# EAGLE design Precharge Board (EAGLE 6.5.1)
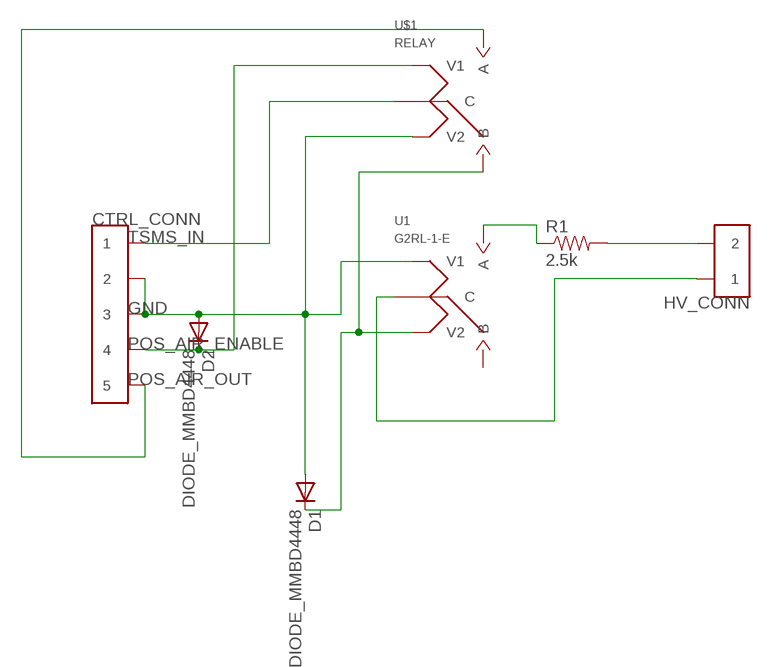
[diagram p0: schematic, sheet 1]

## Parts
CTRL_CONN  CONN_5  [CONNECTOR_5]
D1  DIODE_MMBD4448  [SOT-23-3]
D2  DIODE_MMBD4448  [SOT-23-3]
HV_CONN  CONN_2  [CONNECTOR_2]
R1  2.5k  FS20SERIES  [VISHAY_FS20W_RES]
U1  G2RL-1-E  [G2RL-1-E_RELAY]
U$1  RELAY  [RELAY]

## Nets
GND: CTRL_CONN.3 CTRL_CONN.4 CTRL_CONN.5 CTRL_CONN.6 D1.P$2(A) D2.P$2(A) U1.P$1(V1) U$1.V2
N$4: HV_CONN.3 HV_CONN.4 R1.P$2
N$5: HV_CONN.1 HV_CONN.2 U1.P$3(C) U1.P$6(C)
N$6: D1.P$1(C) U1.P$8(V2) U$1.B
N$9: R1.P$1 U1.P$4(A) U1.P$5(A)
POS_AIR_ENABLE: CTRL_CONN.7 CTRL_CONN.8 D2.P$1(C) U$1.V1
POS_AIR_OUT: CTRL_CONN.9 CTRL_CONN.10 U$1.A
TSMS_IN: CTRL_CONN.1 CTRL_CONN.2 U$1.CENTER(C)
Unconnected: U1.P$2(B) U1.P$7(B)

## Library data of the parts
CTRL_CONN = formula electric:CONN_5
D1 D2 = formula electric:DIODE_MMBD4448
HV_CONN = formula electric:CONN_2
R1 = formula electric:FS20SERIES: Digikey FS20-{R}
U1 = formula electric:G2RL-1-E: G2RL-1-E SPDT Relay, 16A, Digikey: Z2834-ND; COIL: DC 12
U$1 = formula electric:RELAY: Digikey: PB1321-ND

## Board
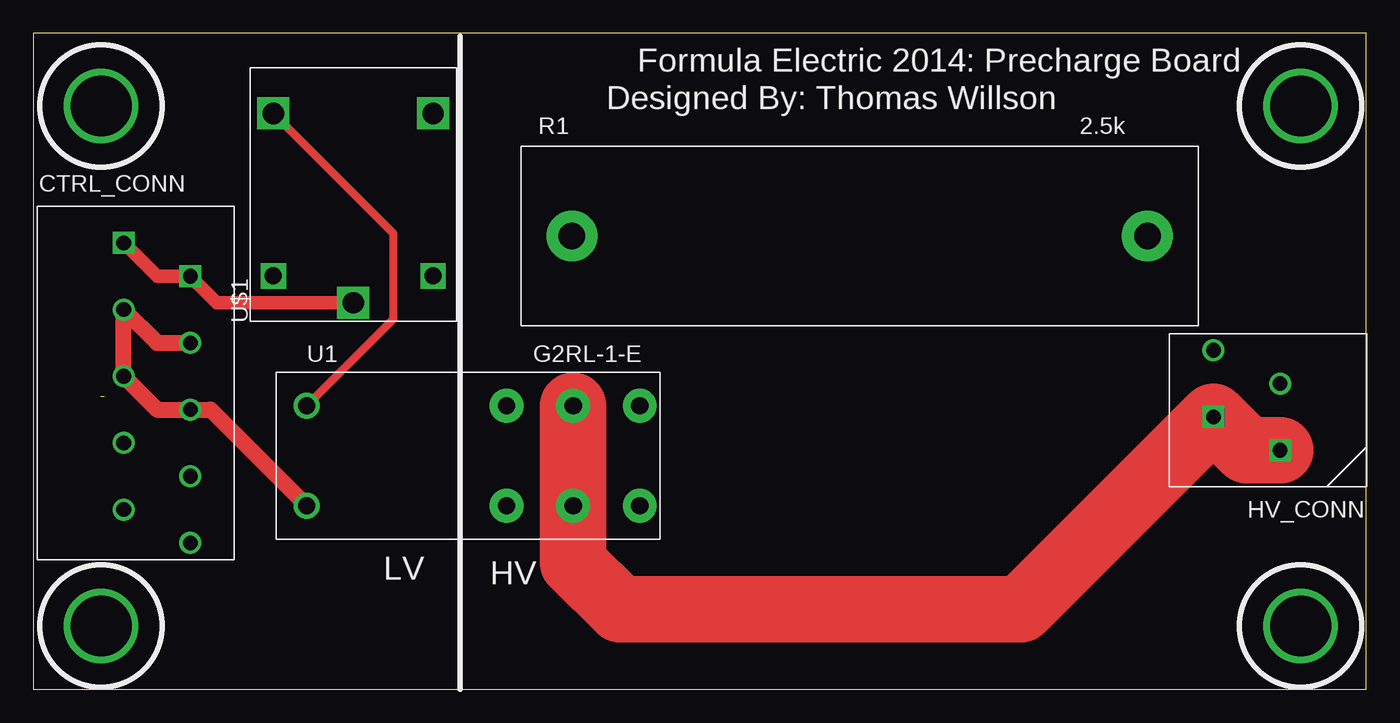
[diagram p1: board, top side]
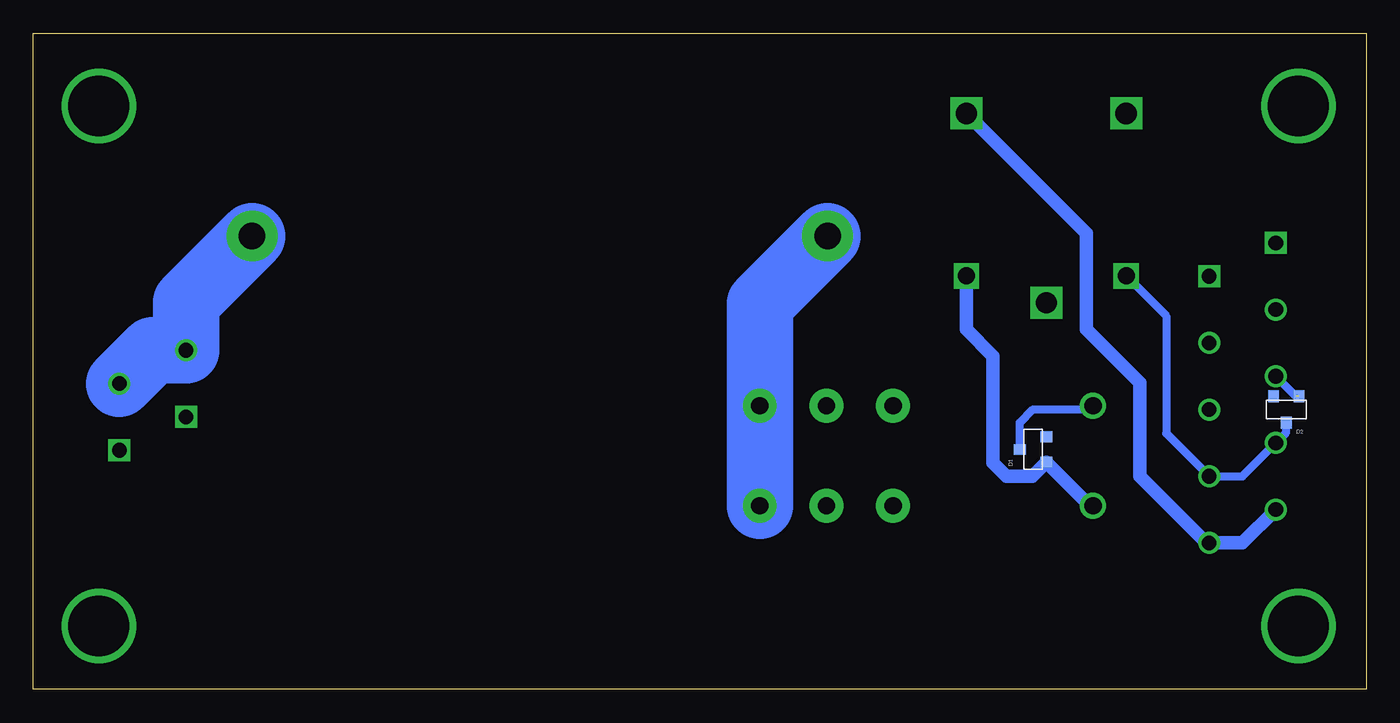
[diagram p2: board, bottom side, seen from below]

Size 100 x 49.2 mm. Coordinates in mm from the lower left corner, seen from the top.
Outline: 0,0 100,0 100,49.2 0,49.2 0,0
Copper layers (1*16): Top 0.035mm / dielectric 1.5mm / Bottom 0.035mm
Design rules "default": minimum track width 10mil, minimum drill 24mil, track to track 8mil, track to pad 8mil, pad to pad 8mil, via to via 8mil, smd to smd 8mil, copper to edge 40mil, drill to drill 8mil, minimum pad ring 10mil, minimum via ring 8mil, stop-mask expansion 4mil, vias tented up to drill 0mil, thermal gap 10mil

### Footprints (pad centres in the part's own frame; a part is rotated, then mirrored left to right if it is on the bottom)
CONNECTOR_5 = drill 1.1 square: 1 0,0; 2 2.5,5 | drill 1.1: 3 5,0; 4 7.5,5; 5 10,0; 6 12.5,5; 7 15,0; 8 17.5,5; 9 20,0; 10 22.5,5
SOT-23-3 = smd 0.8 x 0.9: P$1 0,1; P$2 -0.95,-1; P$3 0.95,-1
CONNECTOR_2 = drill 1.1 square: 1 0,0; 2 2.5,5 | drill 1.1: 3 5,0; 4 7.5,5
VISHAY_FS20W_RES = drill 1.981 pad 3.81: P$1 -21.59,0; P$2 21.59,0
G2RL-1-E_RELAY = drill 1.3: P$1 -15,-3.75; P$8 -15,3.75 | drill 1.3 pad 2.54: P$2 0,-3.75; P$3 5,-3.75; P$4 10,-3.75; P$5 10,3.75; P$6 5,3.75; P$7 0,3.75
RELAY = drill 1.6 square: A 14.199,-5.994; B 14.199,5.994; CENTER 0,0 | drill 1.27 square: V1 2.007,5.994; V2 2.007,-5.994

### Placement (x,y rotation side)
CTRL_CONN  6.78,33.48 270 top
D1  25,18 90 bottom
D2  6,21 180 bottom
HV_CONN  93.54,17.93 90 top
R1  62,34 0 top
U1  35.5,17.52 0 top
U$1  24,29 90 top

### Tracks (layer width: path | path; a pad name or v marks a point on that pad's centre or on a via)
GND  (1 unrouted)
  Top 1.2: U1.P$1 13.29,20.98 CTRL_CONN.6 9.28,20.98 CTRL_CONN.5 CTRL_CONN.3 9.28,25.98 CTRL_CONN.4
  Bottom 0.61: U1.P$1 20.72,13.77 | 5.3,22 CTRL_CONN.5
  Bottom 1: 20.72,13.77 D1.P$2 25.05,16 27,16 28,17 28,25 29.99,26.99 U$1.V2
N$3  (via drill 4.57)
  other vias: 5.08,4.75
N$4
  Bottom 5: R1.P$2 88.54,29.05 HV_CONN.4 91.04,25.43 HV_CONN.3
N$5
  Top 5: HV_CONN.1 91.04,17.93 HV_CONN.2 74.11,6 44,6 40.5,9.5 U1.P$3 U1.P$6
N$6
  Top 0.61: U$1.B 27,34.2 27,27.77 U1.P$8
  Bottom 0.61: D1.P$1 26,20 25,21 20.77,21 U1.P$8
N$9
  Bottom 5: R1.P$1 45.5,28.91 U1.P$5 U1.P$4
N$10  (via drill 4.57)
  other vias: 95.08,4.75
N$11  (via drill 4.57)
  other vias: 95.08,43.75
N$12  (via drill 4.57)
  other vias: 5.08,43.75
POS_AIR_ENABLE
  Bottom 0.61: U$1.V1 15,28 15,19.2 CTRL_CONN.8 9.28,15.98 CTRL_CONN.7 6,19.26 D2.P$1
POS_AIR_OUT
  Bottom 0.61: 11.98,10.98 CTRL_CONN.10
  Bottom 1: U$1.A 21,34.2 21,27 17,23 17,16 11.98,10.98 | CTRL_CONN.10 9.28,10.98 CTRL_CONN.9
TSMS_IN
  Top 1: CTRL_CONN.1 9.28,30.98 CTRL_CONN.2 13.76,29 U$1.CENTER

### Text on the board
tPlace: Formula Electric 2014: Precharge Board | LV | HV
tNames: Designed By: Thomas Willson